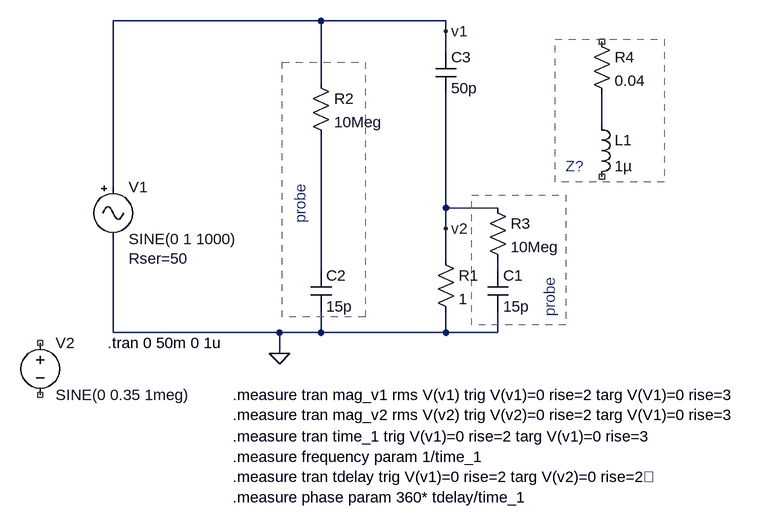
[diagram p0: schematic diy-vna.asc]
diy-vna.asc, the LTspice schematic file:
Version 4
SHEET 1 1200 768
WIRE 176 48 -144 48
WIRE 368 48 176 48
WIRE 368 64 368 48
WIRE 368 96 368 64
WIRE 176 144 176 48
WIRE 608 208 608 160
WIRE -144 304 -144 48
WIRE 368 336 368 160
WIRE 448 336 368 336
WIRE 368 368 368 336
WIRE 368 416 368 368
WIRE 176 432 176 224
WIRE 448 432 448 416
WIRE -144 528 -144 384
WIRE 112 528 -144 528
WIRE 176 528 176 496
WIRE 176 528 112 528
WIRE 368 528 368 496
WIRE 368 528 176 528
WIRE 448 528 448 496
WIRE 448 528 368 528
WIRE 112 560 112 528
FLAG 112 560 0
FLAG 368 368 v2
FLAG 368 64 v1
SYMBOL Misc/signal -144 288 R0
WINDOW 39 24 126 Left 2
SYMATTR SpiceLine Rser=50
SYMATTR InstName V1
SYMATTR Value SINE(0 1 1000)
SYMBOL res 352 400 R0
SYMATTR InstName R1
SYMATTR Value 1
SYMBOL ind 592 192 R0
SYMATTR InstName L1
SYMATTR Value 1µ
SYMATTR SpiceLine Rser=0
SYMBOL cap 432 432 R0
SYMATTR InstName C1
SYMATTR Value 15p
SYMBOL cap 160 432 R0
SYMATTR InstName C2
SYMATTR Value 15p
SYMBOL res 160 128 R0
SYMATTR InstName R2
SYMATTR Value 10Meg
SYMBOL res 432 320 R0
SYMATTR InstName R3
SYMATTR Value 10Meg
SYMBOL res 592 64 R0
SYMATTR InstName R4
SYMATTR Value 0.04
SYMBOL cap 352 96 R0
SYMATTR InstName C3
SYMATTR Value 50p
SYMBOL voltage -256 528 R0
SYMATTR InstName V2
SYMATTR Value SINE(0 0.35 1meg)
TEXT -152 544 Left 2 !.tran 0 50m 0 1u
TEXT 40 688 Left 2 !.measure tran time_1 trig V(v1)=0 rise=2 targ V(v1)=0 rise=3\n.measure frequency param 1/time_1\n.measure tran tdelay trig V(v1)=0 rise=2 targ V(v2)=0 rise=2\n.measure phase param 360* tdelay/time_1
TEXT 40 624 Left 2 !.measure tran mag_v1 rms V(v1) trig V(v1)=0 rise=2 targ V(V1)=0 rise=3\n.measure tran mag_v2 rms V(v2) trig V(v2)=0 rise=2 targ V(V1)=0 rise=3
TEXT 552 272 Left 2 ;Z?
TEXT 144 360 VLeft 2 ;probe
TEXT 528 504 VLeft 2 ;probe
RECTANGLE Normal 116 112 244 504 2
RECTANGLE Normal 408 316 552 516 2
RECTANGLE Normal 536 76 704 296 2

The netlist it stands for:
* diy-vna.asc
V1 v1 0 SINE(0 1 1000) Rser=50
R1 v2 0 1
L1 N001 NC_01 1µ Rser=0
C1 N003 0 15p
C2 N002 0 15p
R2 v1 N002 10Meg
R3 v2 N003 10Meg
R4 NC_02 N001 0.04
C3 v1 v2 50p
V2 NC_03 NC_04 SINE(0 0.35 1meg)
.tran 0 50m 0 1u
.measure tran time_1 trig V(v1)=0 rise=2 targ V(v1)=0 rise=3
.measure frequency param 1/time_1
.measure tran tdelay trig V(v1)=0 rise=2 targ V(v2)=0 rise=2
.measure phase param 360* tdelay/time_1
.measure tran mag_v1 rms V(v1) trig V(v1)=0 rise=2 targ V(V1)=0 rise=3
.measure tran mag_v2 rms V(v2) trig V(v2)=0 rise=2 targ V(V1)=0 rise=3
* Z?
* probe
* probe
.backanno
.end